# Altium schematic sheet ExpansionMain.SchDoc
size A; PageSetup: Record=PageOptions|CenterHorizontal=True|CenterVertical=True|PrintScale=1.54|XCorrection=1.00|YCorrection=1.00|PrintKind=1|BorderSize=5000000|LeftOffset=0|BottomOffset=0|Orientation=2|PaperLength=1000|PaperWidth=1000|Scale=100|PaperSource=7|PrintQuality=-4|MediaType=1|DitherType=10|PaperKind=A3|PrintScaleMode=1
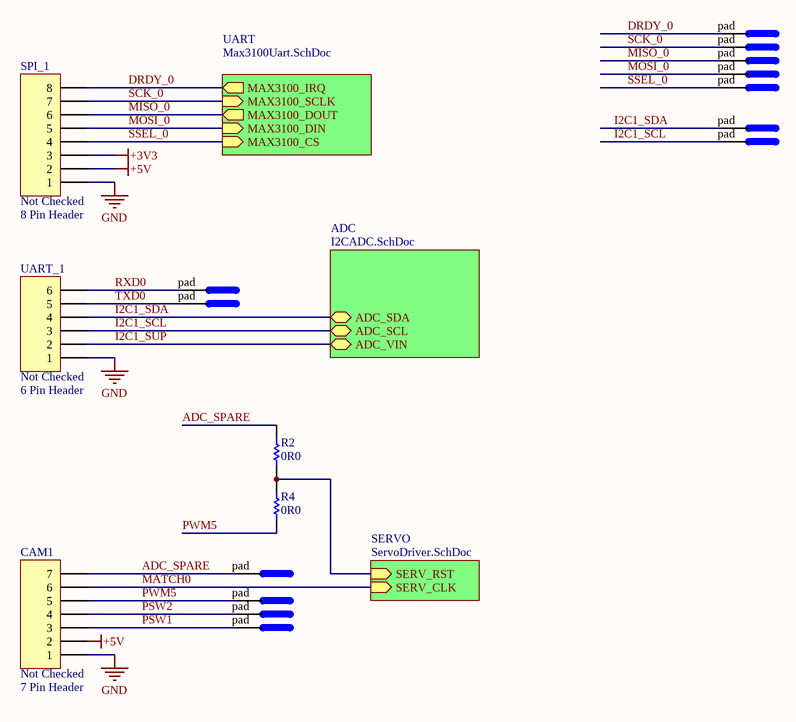
[diagram p0: ExpansionMain.SchDoc]

## Parts
A0  (no value)  [PAD_ROUND]
CAM1  Verify: Not Checked  [CONN_7X1_SMT_RA_1.25MM]  (hidden comment: 7 Pin Header)
DRDY  (no value)  [PAD_ROUND]
MISO  (no value)  [PAD_ROUND]
MOSI  (no value)  [PAD_ROUND]
PWM  (no value)  [PAD_ROUND]
R2  0R0  [0805]  (no BOM)
R4  0R0  [0805]  (no BOM)
RX0  (no value)  [PAD_ROUND]
SCK  (no value)  [PAD_ROUND]
SCL  (no value)  [PAD_ROUND]
SDA  (no value)  [PAD_ROUND]
SPI_1  Verify: Not Checked  [CONN_8X1_SMT_RA_1.25MM]  (hidden comment: 8 Pin Header)
SSEL  (no value)  [PAD_ROUND]
SW1  (no value)  [PAD_ROUND]
SW2  (no value)  [PAD_ROUND]
TX0  (no value)  [PAD_ROUND]
UART_1  Verify: Not Checked  [CONN_6X1_SMT_RA_1.25MM]  (hidden comment: 6 Pin Header)

## Sub-sheets
ADC = I2CADC.SchDoc: ADC_SCL (bidir), ADC_SDA (bidir), ADC_VIN (bidir)
SERVO = ServoDriver.SchDoc: SERV_CLK (in), SERV_RST (in)
UART = Max3100Uart.SchDoc: MAX3100_DIN (in), MAX3100_CS (in), MAX3100_DOUT (out), MAX3100_SCLK (in), MAX3100_IRQ (out)

## Nets
+3V3: SPI_1.3
+5V: CAM1.2 SPI_1.2
GND: CAM1.1 SPI_1.1 UART_1.1
ADC_SPARE: A0.pad CAM1.7 R2.1
DRDY_0: DRDY.pad SPI_1.8 ; sheet UART/MAX3100_IRQ
I2C1_SCL: SCL.pad UART_1.3 ; sheet ADC/ADC_SCL
I2C1_SDA: SDA.pad UART_1.4 ; sheet ADC/ADC_SDA
I2C1_SUP: UART_1.2 ; sheet ADC/ADC_VIN
MATCH0: CAM1.6 ; sheet SERVO/SERV_CLK
MISO_0: MISO.pad SPI_1.6 ; sheet UART/MAX3100_DOUT
MOSI_0: MOSI.pad SPI_1.5 ; sheet UART/MAX3100_DIN
PSW1: CAM1.3 SW1.pad
PSW2: CAM1.4 SW2.pad
PWM5: CAM1.5 PWM.pad R4.2
RXD0: RX0.pad UART_1.6
SCK_0: SCK.pad SPI_1.7 ; sheet UART/MAX3100_SCLK
SSEL_0: SPI_1.4 SSEL.pad ; sheet UART/MAX3100_CS
TXD0: TX0.pad UART_1.5
NetR2_2: R2.2 R4.1 ; sheet SERVO/SERV_RST

## Library data of the parts
A0 DRDY MISO MOSI PWM RX0 SCK SCL SDA SSEL SW1 SW2 TX0 = JP_pad: Pad; pin to pad: pad>1
CAM1 = JP_7PIN HDR_SMT_RA_MOLEX: CONN HDR VERT 7POS .100" SNGL; Manufacturer: Molex; Manufacturer PN: 53261-0771; Prototype: Digikey WM7626CT-ND; LatestRevisionDate: 24 Jun 08; Value: 7 Pin Header
R2 R4 = RS_0R0 0603: RES 0.0 OHM 1/10W 5% 0603 SMD; Manufacturer: Rohm; Manufacturer PN: MCR03EZPJ000; Prototype: DigiKey RHM0.0GCT-ND; LatestRevisionDate: 3 Jun 08; Value: 0R0
SPI_1 = JP_8PIN HDR_SMT_RA_MOLEX: CONN HDR VERT 12POS .100" SNGL; Manufacturer: Molex; Manufacturer PN: 53261-0871; Prototype: Digikey WM7626CT-ND; LatestRevisionDate: 24 Jun 08; Value: 8 Pin Header
UART_1 = JP_6PIN HDR_SMT_RA_MOLEX: CONN HDR VERT 6POS .100" SNGL; Manufacturer: Molex; Manufacturer PN: 53261-0671; Prototype: Digikey WM7624CT-ND; LatestRevisionDate: 24 Jun 08; Value: 6 Pin Header